# Altium project ADC_ClimateRigg.PrjPcb
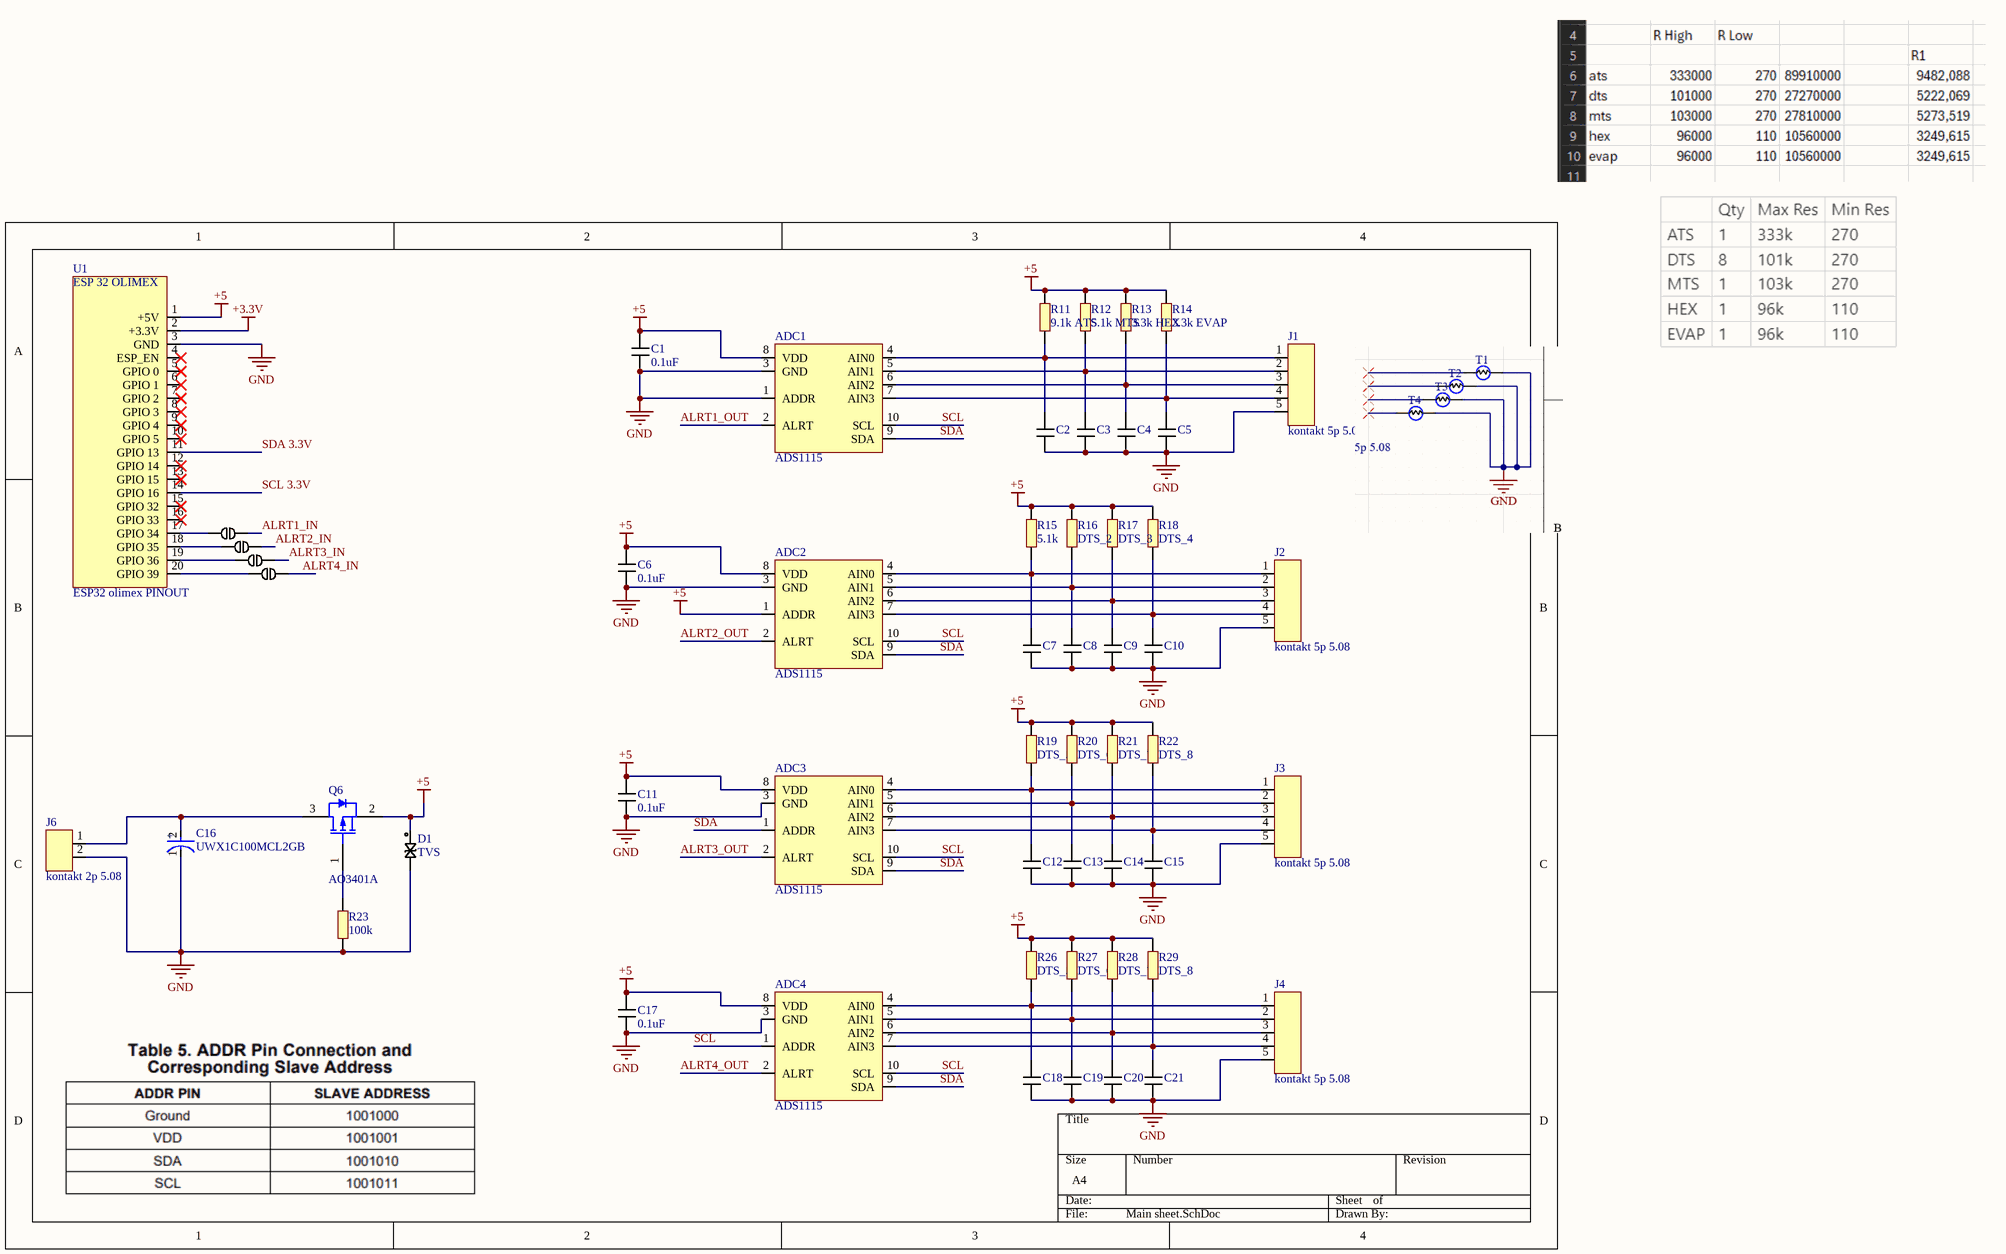
[diagram p0: Main sheet.SchDoc]
2 sheets, 72 parts. Net scope: global (net labels, ports and power ports of the same name join across sheets).
Board file: PCB1.PcbDoc
Sheets:
  Main sheet.SchDoc
  Level Switch.SchDoc

## Sheet Main sheet.SchDoc
size A4; SheetNumber: 1; SheetTotal: 2

### Parts
ADC1  ADS1115  [TSSOP50P490X110-10N ADS1115]
ADC2  ADS1115  [TSSOP50P490X110-10N ADS1115]
ADC3  ADS1115  [TSSOP50P490X110-10N ADS1115]
ADC4  ADS1115  [TSSOP50P490X110-10N ADS1115]
C1  0.1uF  [Cap 0603]
C2  C0603  [Cap 0603]  (value not drawn)
C3  C0603  [Cap 0603]  (value not drawn)
C4  C0603  [Cap 0603]  (value not drawn)
C5  C0603  [Cap 0603]  (value not drawn)
C6  0.1uF  [Cap 0603]
C7  C0603  [Cap 0603]  (value not drawn)
C8  C0603  [Cap 0603]  (value not drawn)
C9  C0603  [Cap 0603]  (value not drawn)
C10  C0603  [Cap 0603]  (value not drawn)
C11  0.1uF  [Cap 0603]
C12  10uf  [Cap 0603]  (value not drawn)
C13  C0603  [Cap 0603]  (value not drawn)
C14  C0603  [Cap 0603]  (value not drawn)
C15  C0603  [Cap 0603]  (value not drawn)
C16  UWX1C100MCL2GB  [FP-UWX1C100MCL2GB-MFG]
C17  0.1uF  [Cap 0603]
C18  10uf  [Cap 0603]  (value not drawn)
C19  C0603  [Cap 0603]  (value not drawn)
C20  C0603  [Cap 0603]  (value not drawn)
C21  C0603  [Cap 0603]  (value not drawn)
D1  TVS  [DO-214AA P6SMB]
J1  kontakt 5p 5.08  [Kontakt 5P 3.5]
J2  kontakt 5p 5.08  [Kontakt 5P 3.5]
J3  kontakt 5p 5.08  [Kontakt 5P 3.5]
J4  kontakt 5p 5.08  [Kontakt 5P 3.5]
J6  kontakt 2p 5.08  [Kontakt 2P 5.08]
JUMP1  Solder jumper  [jumper]  (value not drawn)
JUMP2  Solder jumper  [jumper]  (value not drawn)
JUMP3  Solder jumper  [jumper]  (value not drawn)
JUMP4  Solder jumper  [jumper]  (value not drawn)
Q6  AO3401A  [AO-SOT-23-3L_V]
R11  9.1k ATS  [Res 0603]
R12  5.1k MTS  [Res 0603]
R13  3.3k HEX  [Res 0603]
R14  3.3k EVAP  [Res 0603]
R15  5.1k  [Res 0603]
R16  DTS_2  [Res 0603]
R17  DTS_3  [Res 0603]
R18  DTS_4  [Res 0603]
R19  DTS_5  [Res 0603]
R20  DTS_6  [Res 0603]
R21  DTS_7  [Res 0603]
R22  DTS_8  [Res 0603]
R23  100k  [Res 0603]
R26  DTS_5  [Res 0603]
R27  DTS_6  [Res 0603]
R28  DTS_7  [Res 0603]
R29  DTS_8  [Res 0603]
U1  ESP32 olimex PINOUT  [ESP32 OLIMEX POE]

### Nets
+3.3V: U1.2(+3.3V)
+5: ADC1.8(VDD) ADC2.1(ADDR) ADC2.8(VDD) ADC3.8(VDD) ADC4.8(VDD) C1.2 C6.2 C11.2 C17.2 D1.1 Q6.2(SOURCE) R11.2 R12.2 R13.2 R14.2 R15.2 R16.2 R17.2 R18.2 R19.2 R20.2 R21.2 R22.2 R26.2 R27.2 R28.2 R29.2 U1.1(+5V)
GND: ADC1.1(ADDR) ADC1.3(GND) ADC2.3(GND) ADC3.3(GND) ADC4.3(GND) C1.1 C2.1 C3.1 C4.1 C5.1 C6.1 C7.1 C8.1 C9.1 C10.1 C11.1 C12.1 C13.1 C14.1 C15.1 C16.1(C) C17.1 C18.1 C19.1 C20.1 C21.1 D1.2 J1.5 J2.5 J3.5 J4.5 J6.2 R23.1 U1.3(GND)
ALRT1_IN: JUMP4.2
ALRT1_OUT: ADC1.2(ALRT)
ALRT2_IN: JUMP1.2
ALRT2_OUT: ADC2.2(ALRT)
ALRT3_IN: JUMP2.2
ALRT3_OUT: ADC3.2(ALRT)
ALRT4_IN: JUMP3.2
ALRT4_OUT: ADC4.2(ALRT)
SCL: ADC1.10(SCL) ADC2.10(SCL) ADC3.10(SCL) ADC4.1(ADDR) ADC4.10(SCL)
SCL 3.3V: U1.14(GPIO_16)
SDA: ADC1.9(SDA) ADC2.9(SDA) ADC3.1(ADDR) ADC3.9(SDA) ADC4.9(SDA)
SDA 3.3V: U1.11(GPIO_13)
NetADC1_4: ADC1.4(AIN0) C2.2 J1.1 R11.1
NetADC1_5: ADC1.5(AIN1) C3.2 J1.2 R12.1
NetADC1_6: ADC1.6(AIN2) C4.2 J1.3 R13.1
NetADC1_7: ADC1.7(AIN3) C5.2 J1.4 R14.1
NetADC2_4: ADC2.4(AIN0) C7.2 J2.1 R15.1
NetADC2_5: ADC2.5(AIN1) C8.2 J2.2 R16.1
NetADC2_6: ADC2.6(AIN2) C9.2 J2.3 R17.1
NetADC2_7: ADC2.7(AIN3) C10.2 J2.4 R18.1
NetADC3_4: ADC3.4(AIN0) C12.2 J3.1 R19.1
NetADC3_5: ADC3.5(AIN1) C13.2 J3.2 R20.1
NetADC3_6: ADC3.6(AIN2) C14.2 J3.3 R21.1
NetADC3_7: ADC3.7(AIN3) C15.2 J3.4 R22.1
NetADC4_4: ADC4.4(AIN0) C18.2 J4.1 R26.1
NetADC4_5: ADC4.5(AIN1) C19.2 J4.2 R27.1
NetADC4_6: ADC4.6(AIN2) C20.2 J4.3 R28.1
NetADC4_7: ADC4.7(AIN3) C21.2 J4.4 R29.1
NetC16_2: C16.2(A) J6.1 Q6.3(DRAIN)
NetJUMP1_1: JUMP1.1 U1.18(GPIO_35)
NetJUMP2_1: JUMP2.1 U1.19(GPIO_36)
NetJUMP3_1: JUMP3.1 U1.20(GPIO_39)
NetJUMP4_1: JUMP4.1 U1.17(GPIO_34)
NetQ6_1: Q6.1(GATE) R23.2

Not connected (* = marked no-connect by the designer): U1 4(ESP_EN)* 5(GPIO_0)* 6(GPIO_1)* 7(GPIO_2)* 8(GPIO_3)* 9(GPIO_4)* 10(GPIO_5)* 12(GPIO_14)* 13(GPIO_15)* 15(GPIO_32)* 16(GPIO_33)*

### Notes on the sheet
- Resistance for Thermistor unknown.
  Vout=VS(RTh/(Rth+R1))
  AIN=5(RTH/(RTH+10k))
  Edit: Min Max resistance known.
  R1=SQR of Rmax *Rmin
- (in symbol CMP-00267-00203106-1) +
- (in symbol ESP32 olimex PINOUT) ESP 32 OLIMEX

### Library data of the parts
ADC1-ADC4 = ADS1113: 4-Channel Single ADC Delta-Sigma 860sps 16-bit Serial 10-Pin VSSOP T/R; Manufacturer: Texas Instruments; Manufacturer Part Number: ADS1115IDGSR; Interface: I2C; Number of Bits: 16; Sampling Rate: 860S/s; Number of A/D Converters: 1; Resolution: 16b; Polarity: Bipolar; Min Supply Voltage: 2V; Max Supply Voltage: 5.5V; Conversion Rate: 0.86KS/s; Number of Inputs: 4; Integral Nonlinearity (INL): 1LSB; Power Dissipation: 900uW; Nominal Supply Current: 150uA; Number of Channels: 2; Supplier: Mouser; Supplier Part Number: 595-ADS1115IDGSR; RoHS: Yes; Category: Analog to Digital Converters (ADCs); Stock: 9640; Pricing: 1=5,34, 10=3,91, 50=3,91, 100=3,3, 1000=2,64, 10000=2,49 (USD); Case/Package: VSSOP; Pins: 10; Contact Plating: Gold; Min Operating Temperature: -40°C; Max Operating Temperature: 125°C; Package Quantity: 2500; Packaging: Tape and Reel; Number of Converters: 1; Supply Type: Single; Max Supply Voltage (DC): 5.5V; Min Supply Voltage (DC): 2V; Series: -; Length: 3mm; Width: 3mm; Height: 1.07mm; Thickness: 1.02mm; Lead Free: Lead Free; Reach SVHC Compliant: No; RoHS Compliant: Yes; ComponentLink1URL: https://datasheet.ciiva.com/4031/47725463s8438921n7713-4031028.pdf?src-supplier=Arrow+Electronics; ComponentLink1Description: https://datasheet.ciiva.com/4031/47725463s8438921n7713-4031028.pdf?src-supplier=Arrow+Electronics
C1 C6 C11 C17 = C0603: C14663
  C1: Parameter 1: *
C2-C5 C7-C10 C12-C15 C18-C21 = C0603: C96446
C16 = CMP-00267-00203106-1: UWX1C100MCL2GB WX Series 10 uF 16 V 85°C Ø3 x 5.4 mm SMT Chip Aluminum Electrolytic Cap; NexarPartId: 203106; Leakage Current: 3µA; Capacitance: 10µF; Voltage Rating: 16V; Life (Hours): 2000hours; Dielectric Material: Aluminium; Tolerance: 20%; Dissipation Factor: 19%; Ripple Current (AC): 18mA; Lead Diameter: 800µm; Height - Seated (Max): 2.9972mm; Lead Free: Lead Free; Length: 5.4mm; Mount: Surface Mount; Min Operating Temperature: -40°C; Schedule B: 8532220020, 8532220020; Width: 3.3mm; Voltage: 16V; Features: General Purpose; Ripple Current: 18mA; Lead Pitch: 800µm; RoHS: Compliant; Voltage Rating (AC): 16V; Max Operating Temperature: 85°C; Height: 5.4mm; Case/Package: SMD/SMT; Radiation Hardening: No; REACH SVHC: No SVHC; Voltage Rating (DC): 16V; Diameter: 3mm; Termination: SMD/SMT; Packaging: Cut Tape; Number of Pins: 2
D1 = TVS: jlc: C78395; Manufacturer part number: P6SMB6.8CA/TR13; Manufacturer: Brightking
Q6 = CMP-2000-05778-1: P-Channel MOSFET, 30 V, 4 A, -55 to 150 degC, 3-Pin SOT-23-3L, RoHS, Tape and Reel; Manufacturer: Alpha and Omega; Output Power (Max): NotRequiredW; Power Dissipation: 1.4W; Rad Hardened: No; Drain Efficiency: NotRequired%; Drain-Source On-Volt: 30V; Noise Figure: NotRequireddB; Frequency (Max): NotRequiredMHz; Number of  Elements: 1; Gate-Source Voltage (Max): ?12V; Drain Current (Max): 4A; Channel Mode: Enhancement; Drain-Source On-Res: 0.044ohm; Type: PowerMOSFET; Polarity: P; Package URL: http://www.aosmd.com/res/packaging_information/SOT-23-3L.pdf; Datasheet URL: http://www.aosmd.com/res/data_sheets/AO3401A.pdf; Package Type: SOT-23; Package Description: 3-Pin Small Outline Transistor, Body 2.95 x 1.6 mm, Pitch 0.95 mm; Mounting: SurfaceMount; Manufacturer URL: http://www.aosmd.com/; Continuous Drain Current: 4A; Package Reference: SOT-23-3L; Mounting Technology: SurfaceMount; Operating Temperature Classification: Military; Power Gain: NotRequireddB; Datasheet Version: Rev. 3, 03/2011; Operating Temp Range: -55Cto150C; Pin Count: 3
R11 = R0603: ATS / Thermistor: 270-333k / R11: 9.1k
R12 = R0603: MTS / Thermistor: 103k / R12: 5.1k
R13 = R0603: HEX / Thermistor: 96k / R13: 3.3k
R14 = R0603: EVAP / Thermistor: 96k / R14: 3.3k
R15 = R0603: DTS_1 / Thermistor: 101k / R15: 5.1k
R16 = R0603: DTS_2 / Thermistor: 101k / R16: 5.1k
R17 = R0603: DTS_3 / Thermistor: 101k / R17: 5.1k
R18 = R0603: DTS_4 / Thermistor: 101k / R18: 5.1k
R19 R26 = R0603: DTS_5 / Thermistor: 101k / R19: 5.1k
R20 R27 = R0603: DTS_6 / Thermistor: 101k / R20: 5.1k
R21 R28 = R0603: DTS_7 / Thermistor: 101k / R21: 5.1k
R22 R29 = R0603: DTS_8 / Thermistor: 101k / R22: 5.1k
R23 = R0603

## Sheet Level Switch.SchDoc
size A4; SheetNumber: 2; SheetTotal: 2
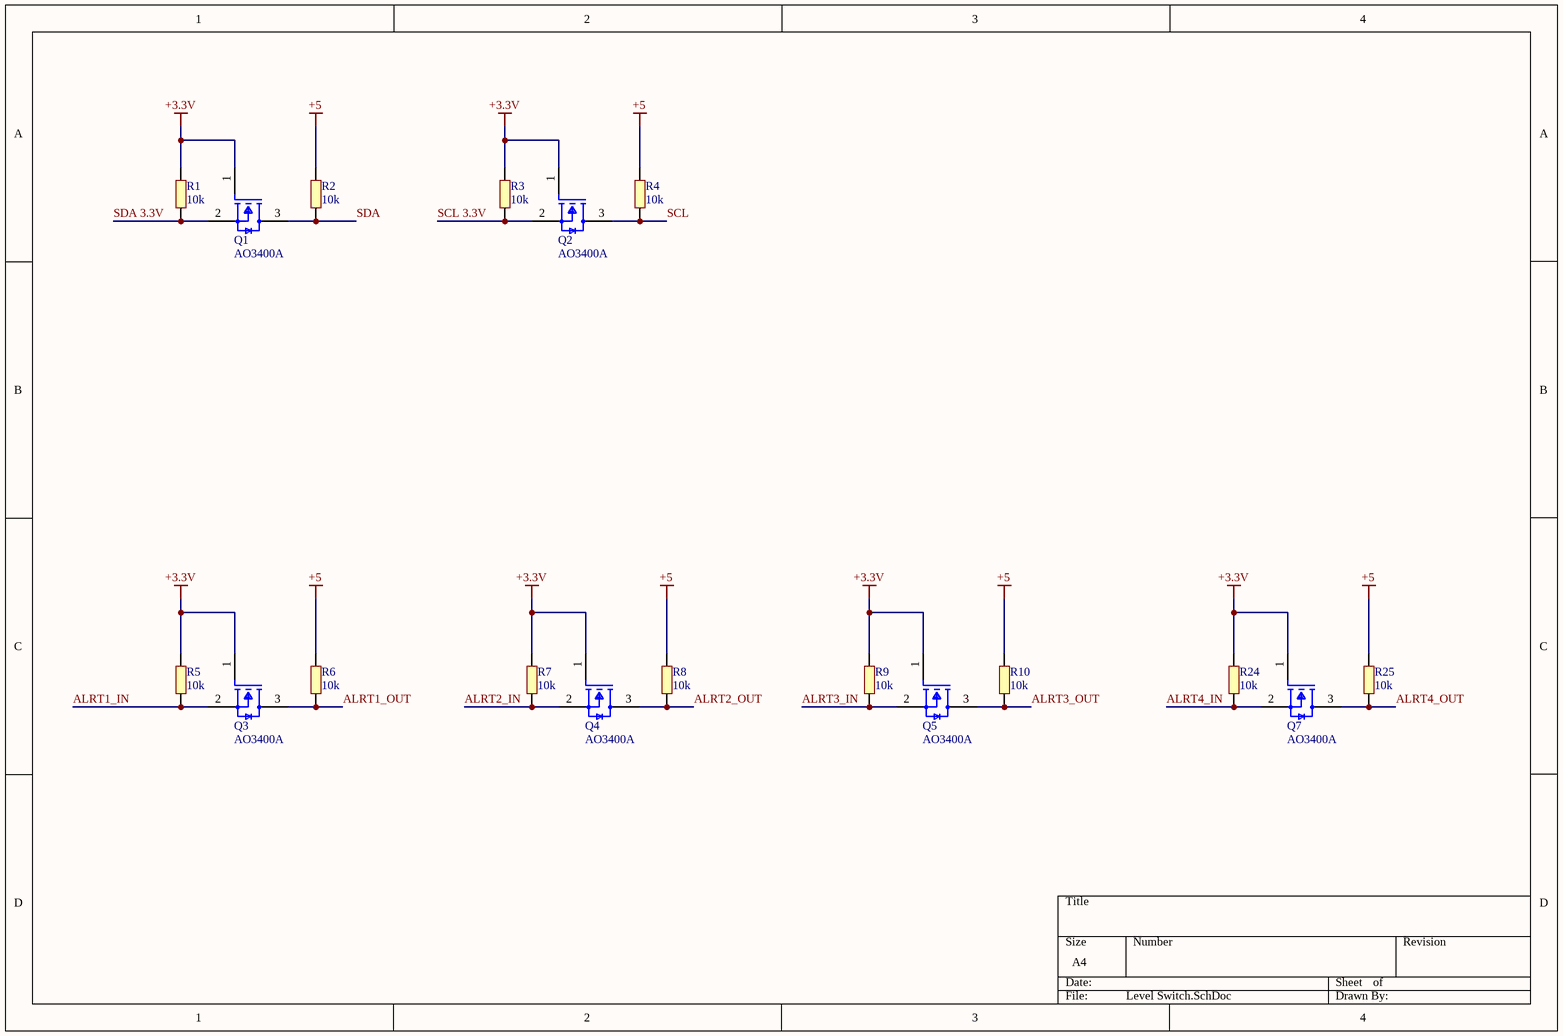
[diagram p1: Level Switch.SchDoc]

### Parts
Q1  AO3400A  [FP-SOT23-MFG]
Q2  AO3400A  [FP-SOT23-MFG]
Q3  AO3400A  [FP-SOT23-MFG]
Q4  AO3400A  [FP-SOT23-MFG]
Q5  AO3400A  [FP-SOT23-MFG]
Q7  AO3400A  [FP-SOT23-MFG]
R1  10k  [Res 0603]
R2  10k  [Res 0603]
R3  10k  [Res 0603]
R4  10k  [Res 0603]
R5  10k  [Res 0603]
R6  10k  [Res 0603]
R7  10k  [Res 0603]
R8  10k  [Res 0603]
R9  10k  [Res 0603]
R10  10k  [Res 0603]
R24  10k  [Res 0603]
R25  10k  [Res 0603]

### Nets
+3.3V: Q1.1(G) Q2.1(G) Q3.1(G) Q4.1(G) Q5.1(G) Q7.1(G) R1.2 R3.2 R5.2 R7.2 R9.2 R24.2
+5: R2.2 R4.2 R6.2 R8.2 R10.2 R25.2
ALRT1_IN: Q3.2(S) R5.1
ALRT1_OUT: Q3.3(D) R6.1
ALRT2_IN: Q4.2(S) R7.1
ALRT2_OUT: Q4.3(D) R8.1
ALRT3_IN: Q5.2(S) R9.1
ALRT3_OUT: Q5.3(D) R10.1
ALRT4_IN: Q7.2(S) R24.1
ALRT4_OUT: Q7.3(D) R25.1
SCL: Q2.3(D) R4.1
SCL 3.3V: Q2.2(S) R3.1
SDA: Q1.3(D) R2.1
SDA 3.3V: Q1.2(S) R1.1

### Library data of the parts
Q1-Q5 Q7 = CMP-83955-000006-1: MOSFET N-CH 30V 5.7A SOT23; Input Capacitance: 630pF; Number of Elements: 1; Rds On Max: 26.5mR; Max Power Dissipation: 1.4W; Gate to Source Voltage (Vgs): 12V; Min Operating Temperature: -55°C; Lead Free: Lead Free; Number of Pins: 3; Drain to Source Voltage (Vdss): 30V; Case/Package: SOT-23; Mount: Surface Mount; Continuous Drain Current (ID): 5.7A; Radiation Hardening: No; Packaging: Tape and Reel; Max Operating Temperature: 150°C; Power Dissipation: 1.4W
R1-R10 R24 R25 = R0603: C25804

## Nets that join several sheets
+3.3V: Main sheet (U1.2), Level Switch (12 pins)
+5: Main sheet (28 pins), Level Switch (6 pins)
ALRT1_IN: Main sheet (JUMP4.2), Level Switch (Q3.2 R5.1)
ALRT1_OUT: Main sheet (ADC1.2), Level Switch (Q3.3 R6.1)
ALRT2_IN: Main sheet (JUMP1.2), Level Switch (Q4.2 R7.1)
ALRT2_OUT: Main sheet (ADC2.2), Level Switch (Q4.3 R8.1)
ALRT3_IN: Main sheet (JUMP2.2), Level Switch (Q5.2 R9.1)
ALRT3_OUT: Main sheet (ADC3.2), Level Switch (Q5.3 R10.1)
ALRT4_IN: Main sheet (JUMP3.2), Level Switch (Q7.2 R24.1)
ALRT4_OUT: Main sheet (ADC4.2), Level Switch (Q7.3 R25.1)
SCL: Main sheet (5 pins), Level Switch (Q2.3 R4.1)
SCL 3.3V: Main sheet (U1.14), Level Switch (Q2.2 R3.1)
SDA: Main sheet (5 pins), Level Switch (Q1.3 R2.1)
SDA 3.3V: Main sheet (U1.11), Level Switch (Q1.2 R1.1)